# Altium schematic sheet Gobang.SchDoc
size A4; Organization: Altium Limited; Address1: L3, 12a Rodborough Rd; Address2: Frenchs Forest; Address3: NSW; Address4: Australia 2086
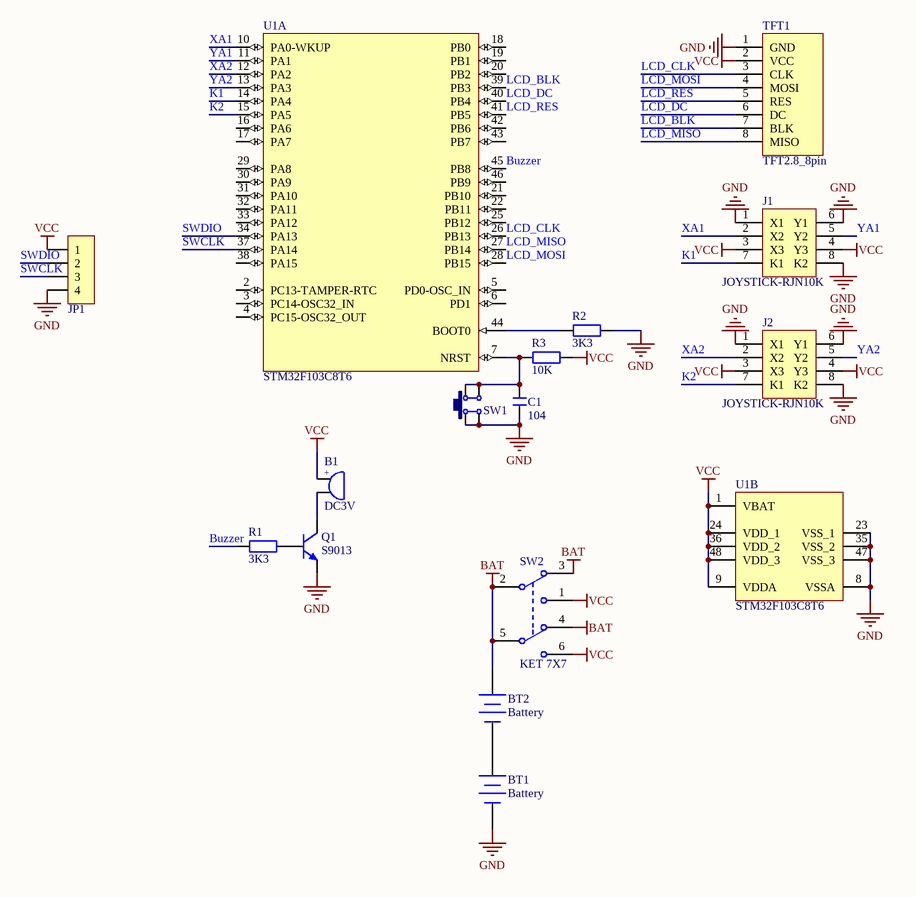
[diagram p0: Gobang.SchDoc]

## Parts
B1  DC3V  [BEEP 6.5x12x8.5]
BT1  Battery  [BATTERY AA x1]
BT2  Battery  [BATTERY AA x1]
C1  104  [C 0805]
J1  JOYSTICK-RJN10K  [JOYSTICK-RJN10K]
J2  JOYSTICK-RJN10K  [JOYSTICK-RJN10K]
JP1  HDR-1X4  [HDR-1X4_H]  (value not drawn)
Q1  S9013  [SOT23-3N]
R1  3K3  [R 0603]
R2  3K3  [R 0603]
R3  10K  [R 0603]
SW1  6x6x5  [TSW DIP-6*6*6]  (value not drawn)
SW2  KET 7X7  [KFT DIP-7X7]
TFT1  TFT2.8_8pin  [TFT2.8_8PIN]
U1  STM32F103C8T6  [LQFP48_N]  (parts A,B of 2)

## Nets
BAT: BT2.1(+) SW2.2(COM2) SW2.3(NO1) SW2.4(NO2) SW2.5(COM2)
GND: BT1.2(-) C1.1 J1.1(X1) J1.6(Y1) J1.8(K2) J2.1(X1) J2.6(Y1) J2.8(K2) JP1.4 Q1.2(E) R2.2 SW1.1 SW1.4 TFT1.1(GND) U1.8(VSSA) U1.23(VSS_1) U1.35(VSS_2) U1.47(VSS_3)
VCC: B1.A J1.3(X3) J1.4(Y3) J2.3(X3) J2.4(Y3) JP1.1 R3.2 SW2.1(NC1) SW2.6(NC2) TFT1.2(VCC) U1.1(VBAT) U1.9(VDDA) U1.24(VDD_1) U1.36(VDD_2) U1.48(VDD_3)
Buzzer: R1.1 U1.45(PB8)
K1: J1.7(K1) U1.14(PA4)
K2: J2.7(K1) U1.15(PA5)
LCD_BLK: TFT1.7(BLK) U1.39(PB3)
LCD_CLK: TFT1.3(CLK) U1.26(PB13)
LCD_DC: TFT1.6(DC) U1.40(PB4)
LCD_MISO: TFT1.8(MISO) U1.27(PB14)
LCD_MOSI: TFT1.4(MOSI) U1.28(PB15)
LCD_RES: TFT1.5(RES) U1.41(PB5)
SWCLK: JP1.3 U1.37(PA14)
SWDIO: JP1.2 U1.34(PA13)
XA1: J1.2(X2) U1.10(PA0-WKUP)
XA2: J2.2(X2) U1.12(PA2)
YA1: J1.5(Y2) U1.11(PA1)
YA2: J2.5(Y2) U1.13(PA3)
NetB1_K: B1.K Q1.3(C)
NetBT1_1: BT1.1(+) BT2.2(-)
NetC1_2: C1.2 R3.1 SW1.2 SW1.3 U1.7(NRST)
NetQ1_1: Q1.1(B) R1.2
NetR2_1: R2.1 U1.44(BOOT0)

Not connected (* = marked no-connect by the designer): U1 2(PC13-TAMPER-RTC) 3(PC14-OSC32_IN) 4(PC15-OSC32_OUT) 5(PD0-OSC_IN) 6(PD1) 16(PA6) 17(PA7) 18(PB0) 19(PB1) 20(PB2) 21(PB10) 22(PB11) 25(PB12) 29(PA8) 30(PA9) 31(PA10) 32(PA11) 33(PA12) 38(PA15) 42(PB6) 43(PB7) 46(PB9)

## Notes on the sheet
- Title
- Size:
- Date:
- A4
- Number:
- Time:
- Revision:
- Sheet
- of
- File:
- (in symbol BEEP) +

## Library data of the parts
B1 = BEEP: 蜂鸣器; 版权归属: 源创客; BOM名称: 蜂鸣器; 学习资源: www.ooocke.com
BT1 BT2 = Battery: Multicell Battery; Published: 24-Mar-1999; LatestRevisionDate: 17-Jul-2002; LatestRevisionNote: Re-released for DXP Platform.; PackageReference: BAT-2; Publisher: Altium Limited
C1 = C: 无极性贴片电容; 版权归属: 源创客; BOM名称: 无极性贴片电容; 学习资源: www.ooocke.com
JP1 = Header 4: 4P接插件; 版权归属: 源创客; BOM名称: 4P接插件; 学习资源: www.ooocke.com
Q1 = 9013-SMD: 低频放大-NPN型; 版权归属: 源创客; 属性: 50V 0.5A 0.625W; BOM名称: 低频放大-NPN型; 学习资源: www.ooocke.com
R1-R3 = R: 贴片电阻; 版权归属: 源创客; BOM名称: 贴片电阻; 学习资源: www.ooocke.com
SW1 = TSW DIP-6x6: 直插6x6轻触开关; 版权归属: 源创客; BOM名称: 直插6x6轻触开关; 学习资源: www.ooocke.com
SW2 = KET 7X7: 7*7自锁开关; 版权归属: 源创客; BOM名称: 7*7自锁开关; 学习资源: www.ooocke.com
TFT1 = TFT2.8_8pin: 240*320
U1 = STM32F103C8T6: STM32 ARM-based 32-bit MCU Performance Line with 64 kB Flash, 20 kB Internal RAM, -40 to +85癈 Temperature, 48-Pin LQFP, Tray; DatasheetVersion: rev13.0, Apr-2011; PackageVersion: rev13, Apr-2011; PackageReference: LQFP48; PackageDescription: 48-Pin Low-Profile Quad Flat Pack, 7 x 7 mm Body, 0.5 mm Pitch (LQFP48); ComponentLink1Description: Manufacturer URL; ComponentLink1URL: http://www.st.com/; ComponentLink2Description: STM32F103 Datasheet; ComponentLink2URL: http://www.st.com/internet/com/TECHNICAL_RESOURCES/TECHNICAL_LITERATURE/DATASHEET/CD00161566.pdf; ComponentLink3Description: STM32 Family Web Page; ComponentLink3URL: www.st.com/stm32